# EAGLE design scartboard-rework (EAGLE 6.0)
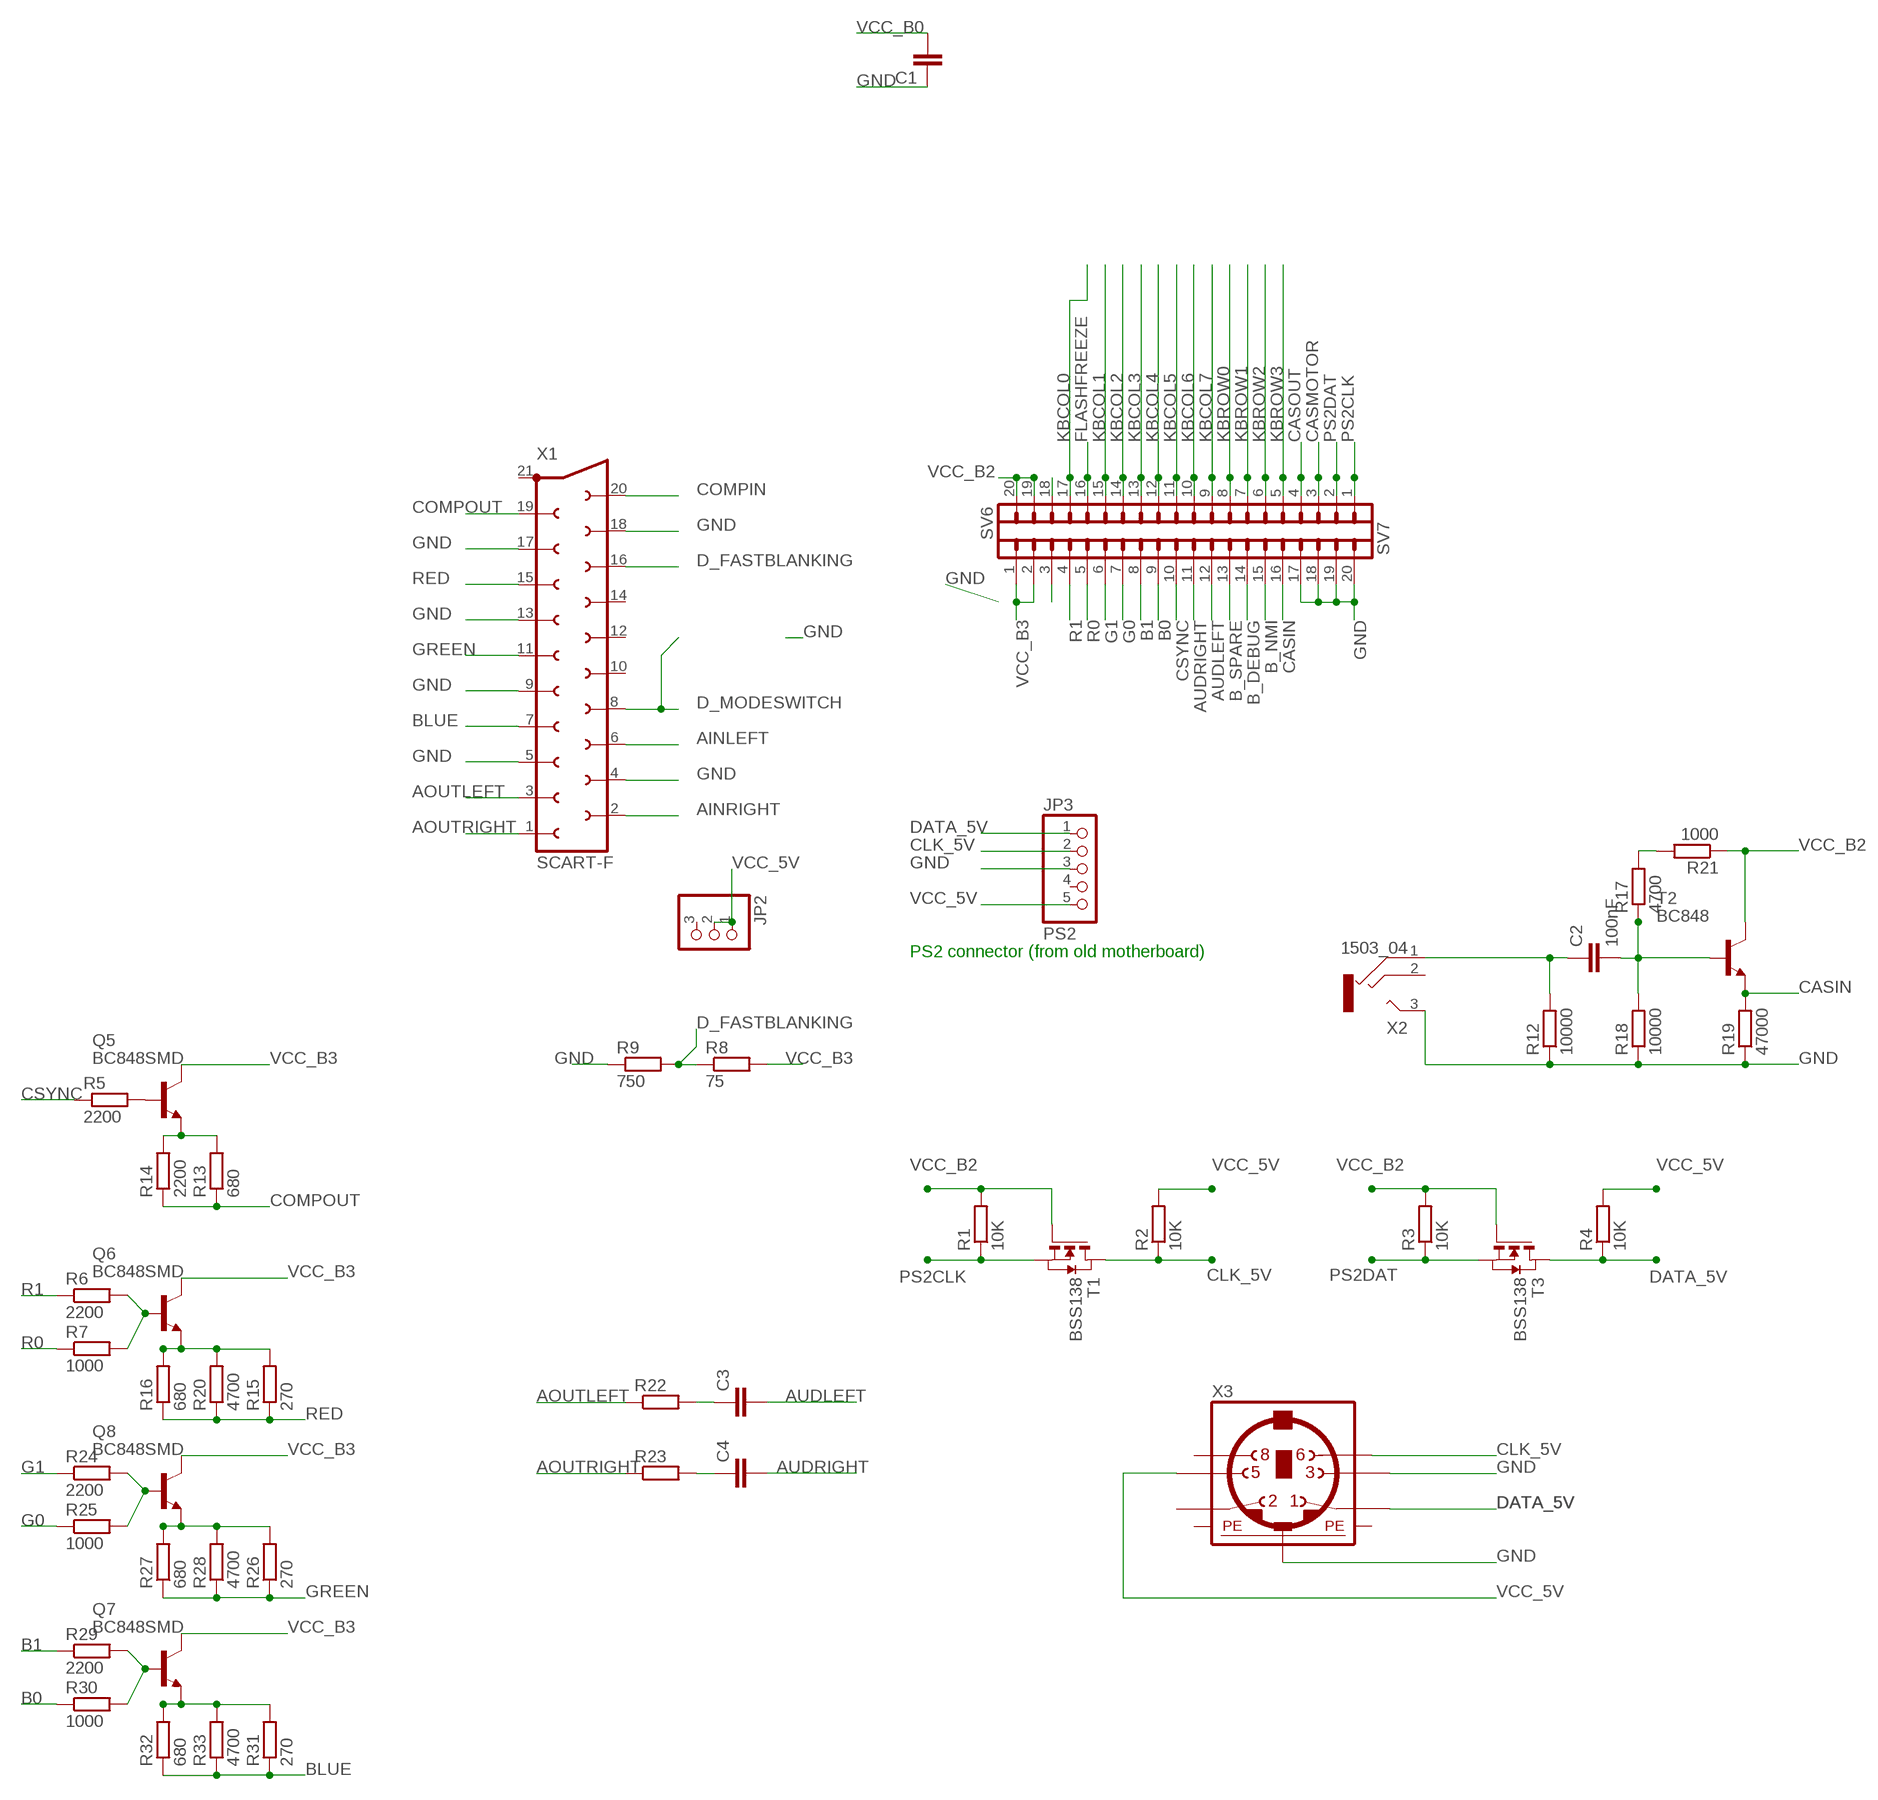
[diagram p0: schematic, sheet 1]

## Parts
C1  C-EUC0603  [C0603]
C2  100nF  C-EUC0603  [C0603]
C3  C-EUC0603  [C0603]
C4  C-EUC0603  [C0603]
JP2  PINHD-1X3  [1X03]
JP3  PS2  PINHD-1X5  [1X05]
Q5  BC848SMD  [SOT23]
Q6  BC848SMD  [SOT23]
Q7  BC848SMD  [SOT23]
Q8  BC848SMD  [SOT23]
R1  10K  R-EU_R0805  [R0805]
R2  10K  R-EU_R0805  [R0805]
R3  10K  R-EU_R0805  [R0805]
R4  10K  R-EU_R0805  [R0805]
R5  2200  R-EU_R0805  [R0805]
R6  2200  R-EU_R0805  [R0805]
R7  1000  R-EU_R0805  [R0805]
R8  75  R-EU_R0805  [R0805]
R9  750  R-EU_R0805  [R0805]
R12  10000  R-EU_R0805  [R0805]
R13  680  R-EU_R0805  [R0805]
R14  2200  R-EU_R0805  [R0805]
R15  270  R-EU_R0805  [R0805]
R16  680  R-EU_R0805  [R0805]
R17  4700  R-EU_R0805  [R0805]
R18  10000  R-EU_R0805  [R0805]
R19  47000  R-EU_R0805  [R0805]
R20  4700  R-EU_R0805  [R0805]
R21  1000  R-EU_R0805  [R0805]
R22  R-EU_M0805  [M0805]
R23  R-EU_M0805  [M0805]
R24  2200  R-EU_R0805  [R0805]
R25  1000  R-EU_R0805  [R0805]
R26  270  R-EU_R0805  [R0805]
R27  680  R-EU_R0805  [R0805]
R28  4700  R-EU_R0805  [R0805]
R29  2200  R-EU_R0805  [R0805]
R30  1000  R-EU_R0805  [R0805]
R31  270  R-EU_R0805  [R0805]
R32  680  R-EU_R0805  [R0805]
R33  4700  R-EU_R0805  [R0805]
SV6  MA20-1  [MA20-1]
SV7  MA20-1  [MA20-1]
T1  BSS138  NMOSSOT23  [SOT-23]
T2  BC848  [SOT23]
T3  BSS138  NMOSSOT23  [SOT-23]
X1  SCART-F  [SCART-F]
X2  1503_04  [1503_04]
X3  MINI_DIN_6  [M_DIN6]

## Nets
AINLEFT: X1.6
AINRIGHT: X1.2
AOUTLEFT: R22.1 X1.3
AOUTRIGHT: R23.1 X1.1
AUDLEFT: C3.2 SV7.12
AUDRIGHT: C4.2 SV7.11
B0: R30.1 SV7.9
B1: R29.1 SV7.8
B_DEBUG: SV7.14
B_NMI: SV7.15
B_SPARE: SV7.13
BLUE: R31.1 R32.1 R33.1 X1.7
CASIN: R19.2 SV7.16 T2.2(E)
CASMOTOR: SV6.3
CASOUT: SV6.4
CLK_5V: JP3.2 R2.1 T1.1(D) X3.6
COMPIN: X1.20
COMPOUT: R13.1 R14.1 X1.19
CSYNC: R5.1 SV7.10
D_FASTBLANKING: R8.1 R9.2 X1.16
D_MODESWITCH: X1.8
DATA_5V: JP3.1 R4.1 T3.1(D) X3.1
FLASHFREEZE: SV6.16
G0: R25.1 SV7.7
G1: R24.1 SV7.6
GND: C1.1 JP3.3 R9.1 R12.1 R18.1 R19.1 SV7.17 SV7.18 SV7.19 SV7.20 X1.4 X1.5 X1.9 X1.13 X1.17 X1.18 X2.3 X3.3 X3.SH2(PE2)
GREEN: R26.1 R27.1 R28.1 X1.11
KBCOL0: SV6.17
KBCOL1: SV6.15
KBCOL2: SV6.14
KBCOL3: SV6.13
KBCOL4: SV6.12
KBCOL5: SV6.11
KBCOL6: SV6.10
KBCOL7: SV6.9
KBROW0: SV6.8
KBROW1: SV6.7
KBROW2: SV6.6
KBROW3: SV6.5
N$1: Q5.2(E) R13.2 R14.2
N$2: Q6.1(B) R6.2 R7.2
N$3: Q5.1(B) R5.2
N$6: Q6.2(E) R15.2 R16.2 R20.2
N$8: C2.2 R17.1 R18.2 T2.1(B)
N$9: Q8.1(B) R24.2 R25.2
N$10: Q8.2(E) R26.2 R27.2 R28.2
N$11: Q7.1(B) R29.2 R30.2
N$12: Q7.2(E) R31.2 R32.2 R33.2
N$13: R17.2 R21.2
N$14: C2.1 R12.2 X2.1
N$15: SV7.3
N$16: SV6.18
N$18: C3.1 R22.2
N$19: C4.1 R23.2
PS2CLK: R1.1 SV6.1 T1.2(S)
PS2DAT: R3.1 SV6.2 T3.2(S)
R0: R7.1 SV7.5
R1: R6.1 SV7.4
RED: R15.1 R16.1 R20.1 X1.15
VCC_5V [power]: JP2.1 JP2.2 JP3.5 R2.2 R4.2 X3.5
VCC_B0: C1.2
VCC_B2: R1.2 R3.2 R21.1 SV6.19 SV6.20 T1.3(G) T2.3(C) T3.3(G)
VCC_B3: Q5.3(C) Q6.3(C) Q7.3(C) Q8.3(C) R8.2 SV7.1 SV7.2
Unconnected: JP2.3 JP3.4 X1.10 X1.12 X1.14 X1.21 X2.2 X3.2 X3.8

## Notes on the sheet
- PS2 connector (from old motherboard)

## Power pins joined to a net without a drawn wire
PE1: X3.SH1(PE1)
PE3: X3.SH3(PE3)

## Library data of the parts
C1 = rcl:C-EU: CAPACITOR, European symbol
C2-C4 = resistor:C-EU: CAPACITOR, European symbol
JP2 = pinhead:PINHD-1X3: PIN HEADER
JP3 = pinhead:PINHD-1X5: PIN HEADER
Q5-Q8 = bc548:BC848*: NPN Transistor
R1-R9 R12-R21 R24-R33 = rcl:R-EU_: RESISTOR, European symbol
R22 R23 = resistor:R-EU_: RESISTOR, European symbol
SV6 SV7 = con-lstb:MA20-1: PIN HEADER; OC_FARNELL: unknown; OC_NEWARK: unknown
T1 T3 = zetex:NMOSSOT23: MOS FET; OC_FARNELL: unknown; OC_NEWARK: unknown
T2 = transistor:BC848: NPN TRANSISTOR
X1 = con-hirschmann:SCART-F: TV SCART CONNECTOR; OC_FARNELL: unknown; OC_NEWARK: unknown
X2 = con-lumberg:1503_04: Jack connectors according to JISC 6560, 3.5 mm, IP 57 Klinkensteckverbinder nach JISC 6560, 3,5 mm, IP 57 Source: http://www.lumberg.com/Produkte/PDFs/1503_04.pdf; OC_FARNELL: 1216981; OC_NEWARK: unknown
X3 = mini_din:MINI_DIN_6

## Net classes
0 default: width 0.2 mm, drill 1.1 mm, clearance 0.2 mm
1 power: width 0.6 mm, drill 1.1 mm, clearance 0.4 mm

## Board
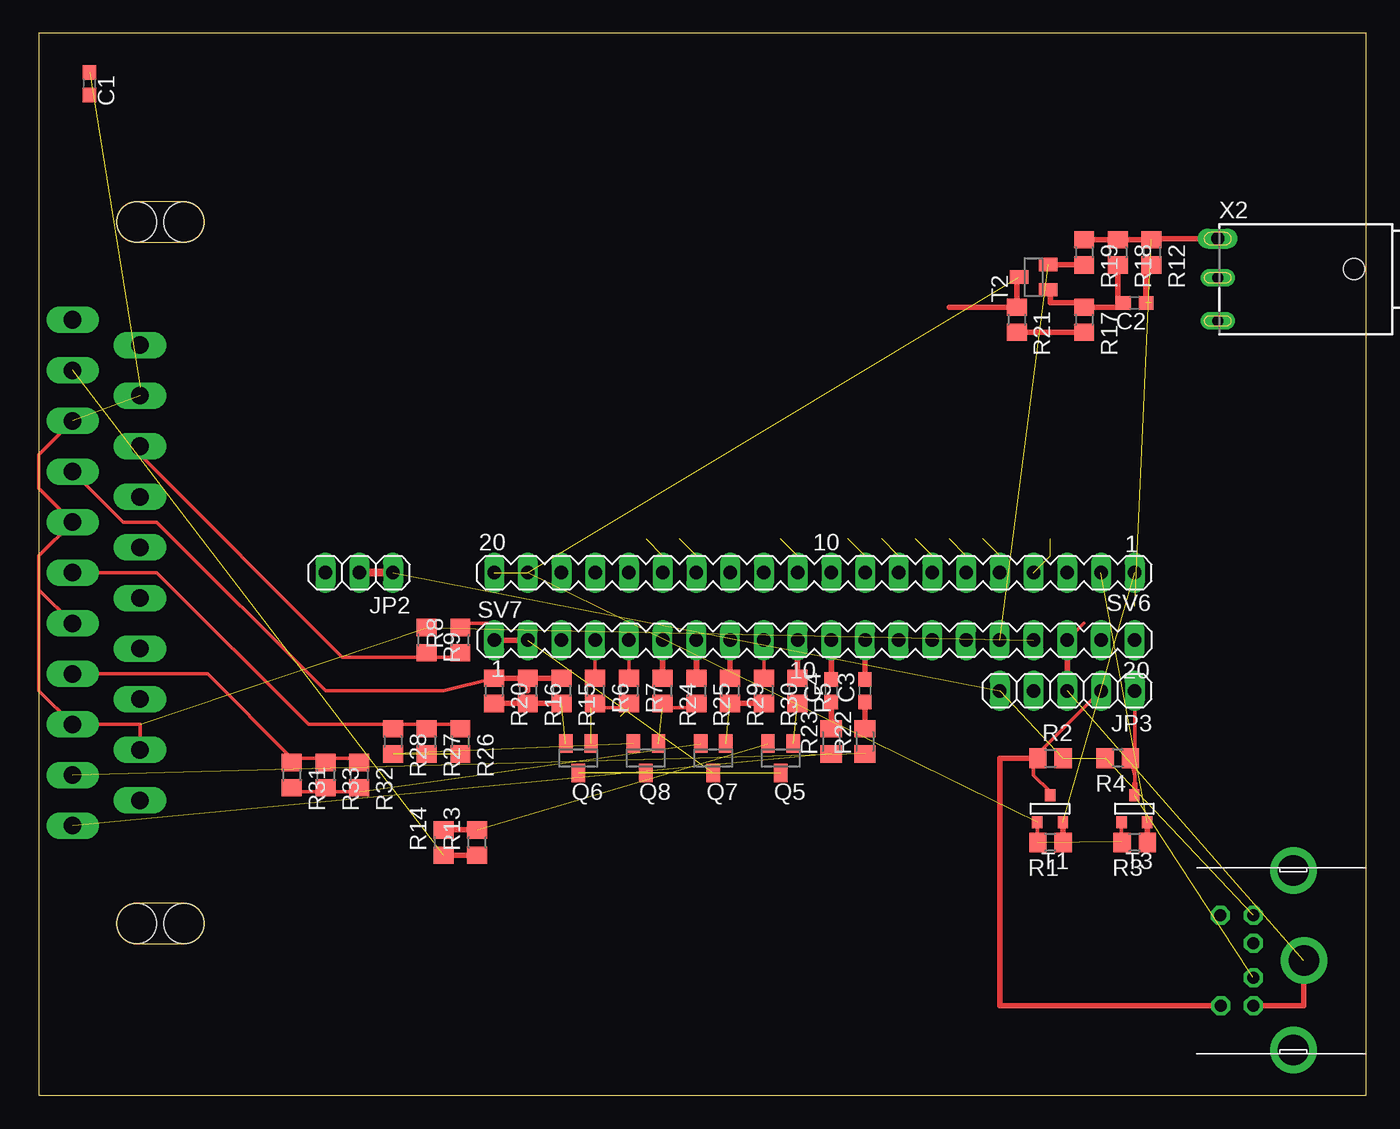
[diagram p1: board, top side]
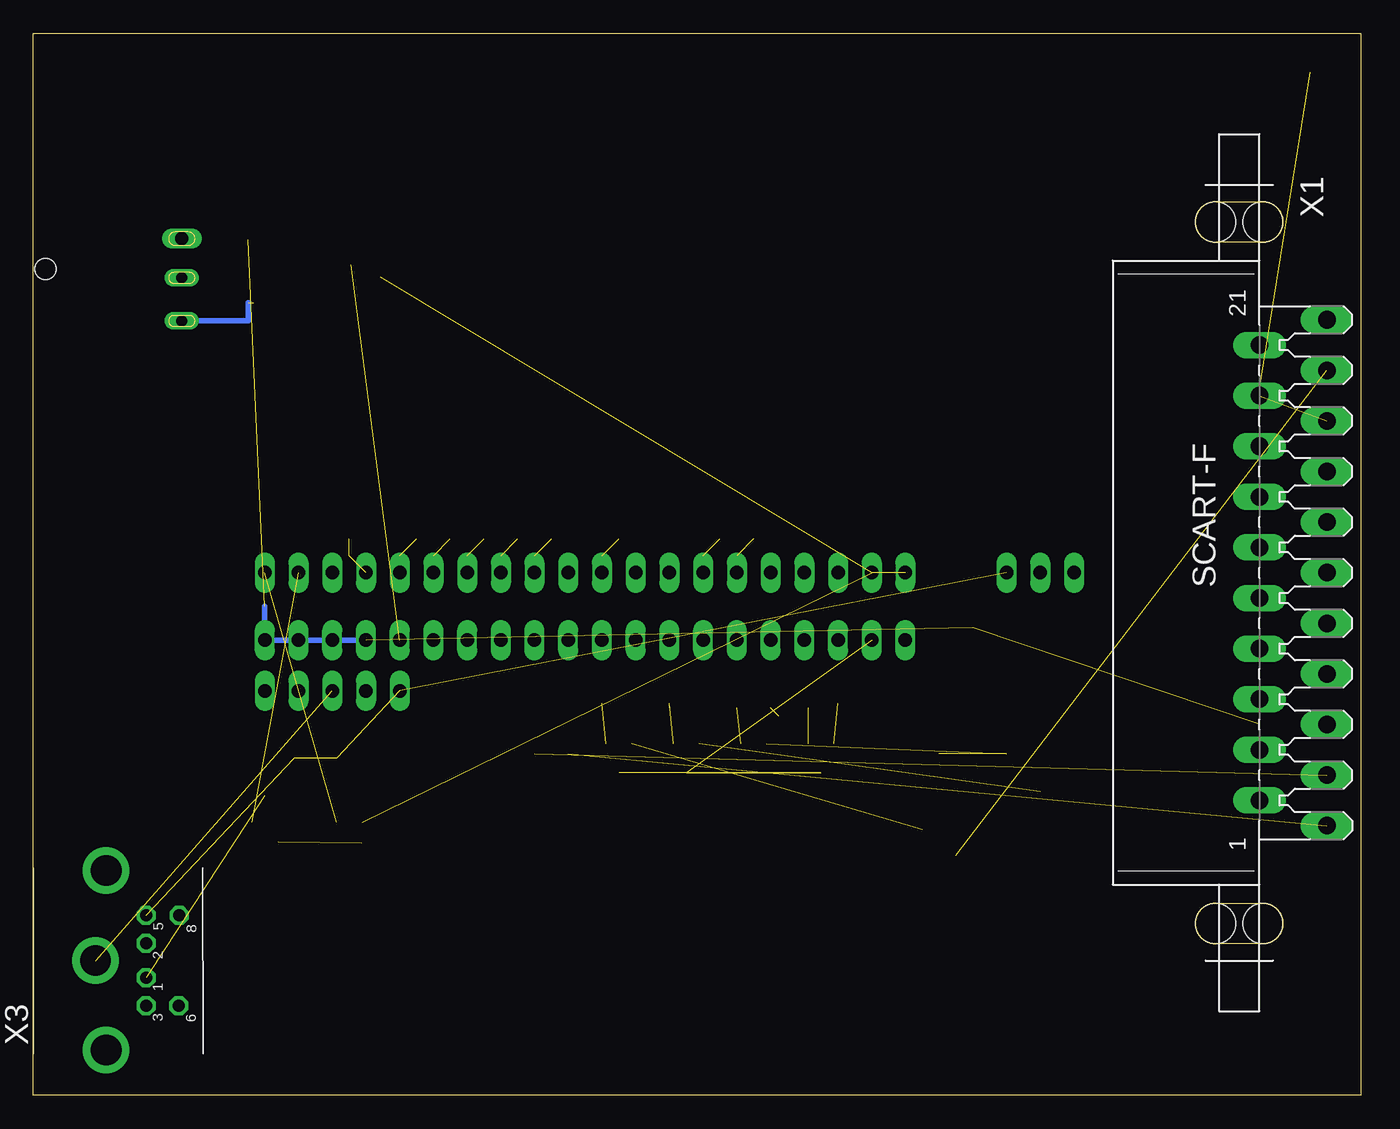
[diagram p2: board, bottom side, seen from below]

Size 100 x 80 mm. Coordinates in mm from the lower left corner, seen from the top.
Outline: 0,0 100,0 100,80 0,80 0,0
Copper layers (1*16): Top 0.035mm / dielectric 1.5mm / Bottom 0.035mm
Design rules: minimum track width 10mil, minimum drill 24mil, track to track 8mil, track to pad 8mil, pad to pad 8mil, via to via 8mil, smd to smd 8mil, copper to edge 40mil, drill to drill 8mil, minimum pad ring 10mil, minimum via ring 8mil, stop-mask expansion 4mil, vias tented up to drill 0mil, thermal gap 10mil

### Footprints (pad centres in the part's own frame; a part is rotated, then mirrored left to right if it is on the bottom)
C0603 = smd 1.1 x 1: 1 -0.85,0; 2 0.85,0
1X03 = drill 1.016 long: 1 -2.54,0; 2 0,0; 3 2.54,0
1X05 = drill 1.016 long: 1 -5.08,0; 2 -2.54,0; 3 0,0; 4 2.54,0; 5 5.08,0
SOT23 = smd 1 x 1.4: 1 -0.95,-1.1; 2 0.95,-1.1; 3 0,1.1
R0805 = smd 1.3 x 1.5: 1 -0.95,0; 2 0.95,0
M0805 = smd 1.3 x 1.6: 1 -0.95,0; 2 0.95,0
MA20-1 = drill 1.016 long: 1 -24.13,0; 2 -21.59,0; 3 -19.05,0; 4 -16.51,0; 5 -13.97,0; 6 -11.43,0; 7 -8.89,0; 8 -6.35,0; 9 -3.81,0; 10 -1.27,0; 11 1.27,0; 12 3.81,0; 13 6.35,0; 14 8.89,0; 15 11.43,0; 16 13.97,0; 17 16.51,0; 18 19.05,0; 19 21.59,0; 20 24.13,0
SOT-23 = smd 0.787 x 0.889: 1 0.025,-1.016; 2 -0.94,1.016; 3 0.991,1.016
SCART-F = drill 1.321 long: 1 19.05,5.08; 2 17.145,0; 3 15.24,5.08; 4 13.335,0; 5 11.43,5.08; 6 9.525,0; 7 7.62,5.08; 8 5.715,0; 9 3.81,5.08; 10 1.905,0; 11 0,5.08; 12 -1.905,0; 13 -3.81,5.08; 14 -5.715,0; 15 -7.62,5.08; 16 -9.525,0; 17 -11.43,5.08; 18 -13.335,0; 19 -15.24,5.08; 20 -17.145,0; 21 -19.05,5.08 | hole 3.023: 26.416,0.254; 26.416,-3.302; -26.416,0.254; -26.416,-3.302
1503_04 = drill 0.8 pad 1.2 long: 1 3.9,-10.25; 2 0.65,-10.25 | drill 1 pad 1.2 long: 3 -2.3,-10.25 | hole 1.6: 0,0
M_DIN6 = drill 0.9 pad 1.422 octagon: 1 -1.3,-3.75; 2 1.3,-3.75; 3 -3.4,-3.75; 5 3.4,-3.75; 6 -3.4,-6.2; 8 3.4,-6.25 | drill 2.3 pad 3.5: SH1 6.8,-0.75; SH2 0,0.05; SH3 -6.75,-0.75

### Placement (x,y rotation side)
C1  3.81,76.2 270 top
C2  82.55,59.69 180 top
C3  62.23,30.48 90 top
C4  59.69,30.48 90 top
JP2  24.13,39.37 180 top
JP3  77.47,30.48 180 top
Q5  55.88,25.4 180 top
Q6  40.64,25.4 180 top
Q7  50.8,25.4 180 top
Q8  45.72,25.4 180 top
R1  76.2,19.05 180 top
R2  76.2,25.4 0 top
R3  82.55,19.05 180 top
R4  81.28,25.4 180 top
R5  57.15,30.48 270 top
R6  41.91,30.48 270 top
R7  44.45,30.48 270 top
R8  31.75,34.29 90 top
R9  29.21,34.29 270 top
R12  83.82,63.5 270 top
R13  33.02,19.05 90 top
R14  30.48,19.05 90 top
R15  39.37,30.48 270 top
R16  36.83,30.48 270 top
R17  78.74,58.42 270 top
R18  81.28,63.5 270 top
R19  78.74,63.5 270 top
R20  34.29,30.48 270 top
R21  73.66,58.42 270 top
R22  62.23,26.67 90 top
R23  59.69,26.67 90 top
R24  46.99,30.48 270 top
R25  49.53,30.48 270 top
R26  31.75,26.67 270 top
R27  29.21,26.67 270 top
R28  26.67,26.67 270 top
R29  52.07,30.48 270 top
R30  54.61,30.48 270 top
R31  19.05,24.13 270 top
R32  24.13,24.13 270 top
R33  21.59,24.13 270 top
SV6  58.42,39.37 180 top
SV7  58.42,34.29 0 top
T1  76.2,21.59 180 top
T2  74.93,61.63 90 top
T3  82.55,21.59 180 top
X1  7.62,39.37 270 bottom
X2  99.06,62.23 270 top
X3  95.25,10.16 90 bottom

### Tracks (layer width: path | path; a pad name or v marks a point on that pad's centre or on a via)
AOUTLEFT  (1 unrouted)
AOUTRIGHT  (1 unrouted)
AUDLEFT
  Top 0.406: C3.2 SV7.12
AUDRIGHT
  Top 0.406: C4.2 SV7.11
B0
  Top 0.254: SV7.9 R30.1
B1
  Top 0.254: 52.07,31.75 R29.1
  Top 0.406: 52.07,31.75 SV7.8
BLUE
  Top 0.254: 21.59,25.4 19.05,25.4 | 21.59,25.4 24.13,25.4 R32.1 | 21.59,25.4 R33.1 | 19.05,25.4 12.7,31.75 X1.7 | 19.05,25.4 R31.1
CASIN  (1 unrouted)
  Top 0.406: T2.2 78.74,62.58 R19.2
CASMOTOR
  Top 0.254: SV6.3 77.47,40.64
CASOUT  (2 unrouted)
CLK_5V
  Top 0.254: 74.93,25.4 74.93,24.13 76.2,22.86 T1.1 | JP3.2 74.93,25.4 | 74.93,25.4 R2.1
  Top 0.406: X3.6 72.39,6.76 72.39,25.4 R2.1
COMPOUT  (1 unrouted)
  Top 0.406: R13.1 R14.1
CSYNC
  Top 0.406: R5.1 SV7.10
D_FASTBLANKING
  Top 0.254: 7.62,49.53 X1.16 7.62,48.26 22.86,33.02 29.21,33.02 | 29.21,33.02 31.75,33.02 R8.1 | 29.21,33.02 R9.2
DATA_5V  (1 unrouted)
  Top 0.254: 82.55,24.13 82.55,22.86 T3.1 | JP3.1 82.55,24.13 | 82.55,24.13 R4.1
  Top 0.406: T3.1 82.55,22.63 82.55,22.86 82.55,23.5 | X3.1 91.44,8.86 91.44,8.89
G0
  Top 0.406: SV7.7 R25.1
G1
  Top 0.406: SV7.6 R24.1
GND  (6 unrouted)
  Top 0.254: X1.4 7.62,27.94 X1.5 0,30.48 0,38.1 | 0,38.1 X1.9 | 7.62,53.34 X1.18 | 29.21,35.56 R9.1 | X1.17 0,48.26 0,45.72 X1.13 0,40.64 0,38.1 | 78.74,35.56 SV7.18
  Top 0.406: JP3.3 SV7.18 | X2.3 83.82,64.53 R12.1 R18.1 R19.1 | X3.3 95.3,6.76 X3.SH2
  Bottom 0.406: SV7.17 SV7.18 SV7.19 SV7.20 82.55,36.83
GREEN
  Top 0.254: 29.21,27.94 26.67,27.94 | 29.21,27.94 31.75,27.94 R26.1 | 29.21,27.94 R27.1 | X1.11 8.89,39.37 20.32,27.94 26.67,27.94 | 26.67,27.94 R28.1
KBCOL1  (1 unrouted)
  Top 0.406: 46.99,40.64 SV6.15
KBCOL2  (1 unrouted)
  Top 0.406: SV6.14 49.53,40.64
KBCOL5  (1 unrouted)
  Top 0.406: SV6.11 57.15,40.64
KBCOL7  (1 unrouted)
  Top 0.406: SV6.9 62.23,40.64
KBROW0  (1 unrouted)
  Top 0.406: SV6.8 64.77,40.64
KBROW1  (1 unrouted)
  Top 0.406: SV6.7 67.31,40.64
KBROW2  (1 unrouted)
  Top 0.406: SV6.6 69.85,40.64
KBROW3  (1 unrouted)
  Top 0.406: SV6.5 72.39,40.64
N$1  (1 unrouted)
  Top 0.406: R13.2 R14.2
N$2  (2 unrouted)
  Top 0.254: R6.2 41.91,29.21 44.45,29.21 R7.2
  Top 0.406: 41.59,29.21 R6.2
N$3  (1 unrouted)
N$6  (1 unrouted)
  Top 0.406: R15.2 R16.2 R20.2
N$8
  Top 0.406: T2.1 76.2,60.68 76.2,59.69 78.74,59.69 R17.1 81.7,59.37 C2.2 81.28,59.69 R18.2
N$9  (1 unrouted)
  Top 0.254: R25.2 49.53,29.21 46.99,29.21 R24.2
N$10  (3 unrouted)
N$11  (2 unrouted)
  Top 0.406: R30.2 R29.2 52.07,29.21
N$12  (1 unrouted)
  Top 0.254: 21.59,22.86 19.05,22.86 R31.2 | 21.59,22.86 24.13,22.86 R32.2 | 21.59,22.86 R33.2
N$13
  Top 0.406: R17.2 R21.2
N$14  (1 unrouted)
  Top 0.406: R12.2 83.4,62.55 C2.1
  Bottom 0.406: X2.1 83.82,58.33 83.82,59.69
N$18
  Top 0.406: C3.1 R22.2
N$19
  Top 0.406: C4.1 R23.2
PS2CLK  (1 unrouted)
  Top 0.406: T1.2 R1.1
PS2DAT  (1 unrouted)
  Top 0.254: SV6.2 80.01,40.64
  Top 0.406: R3.1 T3.2
R0
  Top 0.254: SV7.5 R7.1
R1
  Top 0.254: SV7.4 R6.1
RED
  Top 0.254: X1.15 6.35,43.18 8.89,43.18 21.59,30.48 30.48,30.48 R20.1
  Top 0.406: R16.1 36.83,30.48 | R16.1 R15.1 | R16.1 R20.1
VCC_5V  (4 unrouted)
  Top 0.6: JP2.1 JP2.2
VCC_B2  (4 unrouted)
  Top 0.254: T1.3 75.21,19.09 R1.2 | T3.3 81.56,19.09 R3.2
  Top 0.406: 68.58,59.37 R21.1 73.66,61.63 T2.3
VCC_B3  (4 unrouted)
  Top 0.254: SV7.1 34.29,35.56 31.75,35.56 R8.2
  Top 0.406: SV7.2 SV7.1